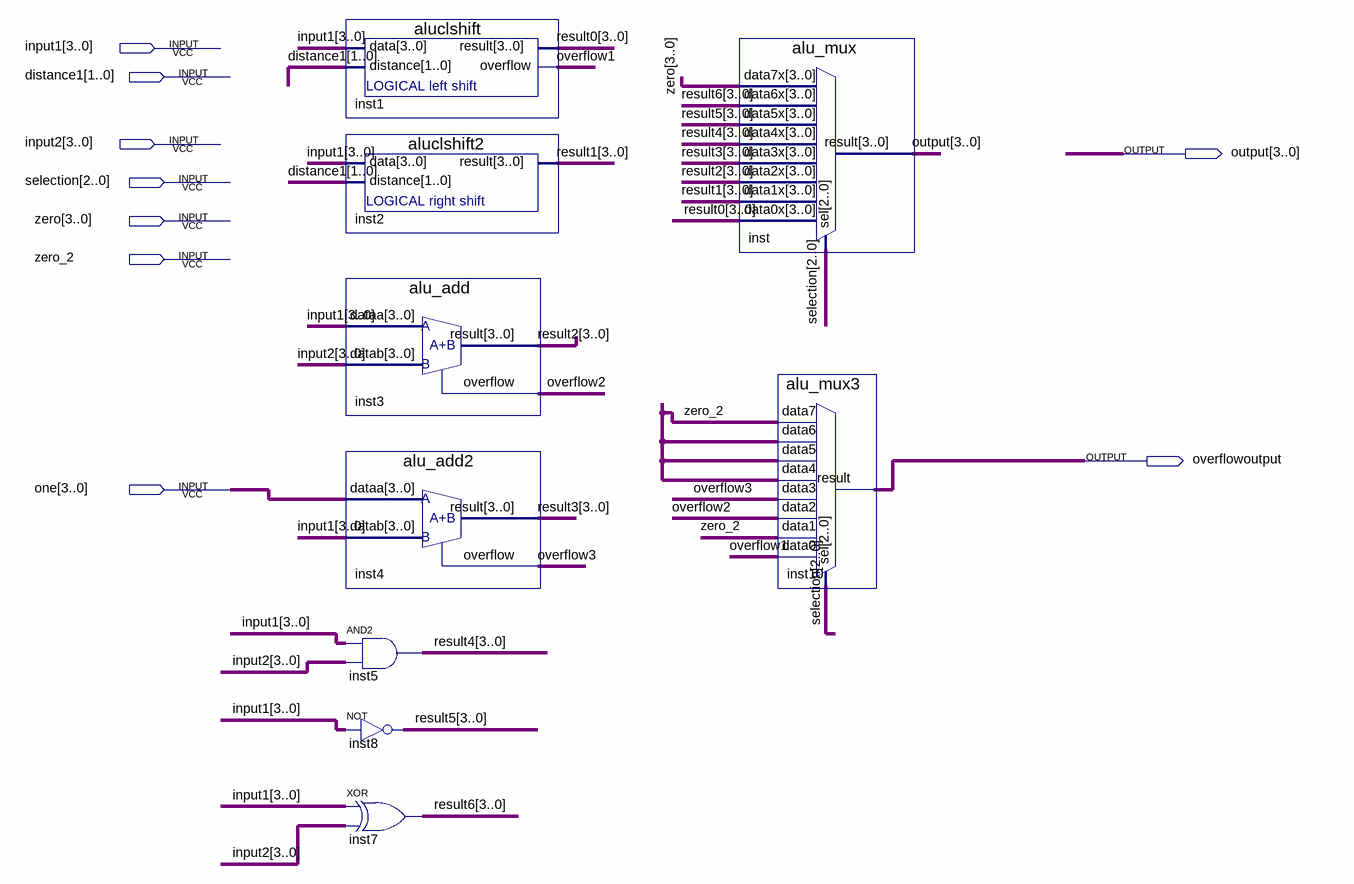
[diagram p0: schematic sheet]
// Quartus schematic osman_taha_gunes_2018510033_ALU.bdf as structural Verilog: 9 symbols, 9 pins
module osman_taha_gunes_2018510033_ALU (
  input  [3:0] input1,
  input  [1:0] distance1,
  input  [3:0] input2,
  input  [2:0] selection,
  input  [3:0] zero,
  input  zero_2,
  input  [3:0] one,
  output [3:0] \output ,
  output overflowoutput
);

  wire overflow1, overflow2, overflow3;
  wire [3:0] result0, result1, result2, result3, result4, result5, result6;

  aluclshift inst1 (.data(input1), .distance(distance1), .result(result0), .overflow(overflow1));
  aluclshift2 inst2 (.data(input1), .distance(distance1), .result(result1));
  alu_add inst3 (.dataa(input1), .datab(input2), .result(result2), .overflow(overflow2));
  alu_add2 inst4 (.dataa(one), .datab(input1), .result(result3), .overflow(overflow3));
  assign result4 = input1 & input2;  // AND2 inst5, 4 bits wide
  assign result5 = ~input1;  // NOT inst8, 4 bits wide
  assign result6 = input1 ^ input2;  // XOR inst7, 4 bits wide
  alu_mux inst (
    .data7x(zero), .data6x(result6), .data5x(result5), .data4x(result4), .data3x(result3), .data2x(result2),
    .data1x(result1), .data0x(result0), .sel(selection), .result(\output ));
  alu_mux3 inst10 (
    .data7(zero_2), .data6(zero_2), .data5(zero_2), .data4(zero_2), .data3(overflow3), .data2(overflow2),
    .data1(zero_2), .data0(overflow1), .sel(selection), .result(overflowoutput));
endmodule
